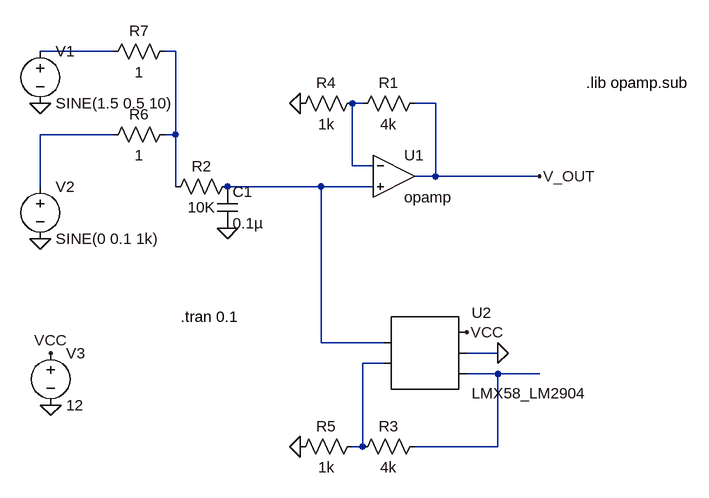
[diagram p0: schematic SensorAmplification.asc]
SensorAmplification.asc, the LTspice schematic file:
Version 4
SHEET 1 880 680
WIRE -656 -48 -768 -48
WIRE -560 -48 -576 -48
WIRE -272 32 -288 32
WIRE -160 32 -192 32
WIRE -656 80 -768 80
WIRE -560 80 -560 -48
WIRE -560 80 -576 80
WIRE -288 128 -288 32
WIRE -256 128 -288 128
WIRE -160 144 -160 32
WIRE -160 144 -192 144
WIRE 0 144 -160 144
WIRE -768 160 -768 80
WIRE -560 160 -560 80
WIRE -336 160 -480 160
WIRE -256 160 -336 160
WIRE -336 400 -336 160
WIRE -240 400 -336 400
WIRE -64 416 -112 416
WIRE -240 432 -272 432
WIRE -64 448 -112 448
WIRE 0 448 -64 448
WIRE -272 560 -272 432
WIRE -272 560 -288 560
WIRE -64 560 -64 448
WIRE -64 560 -192 560
FLAG 0 144 V_OUT
FLAG -768 32 0
FLAG -480 224 0
FLAG -368 32 0
FLAG -768 240 0
FLAG -368 560 0
FLAG -64 416 0
FLAG -752 496 0
FLAG -752 416 VCC
FLAG -112 384 VCC
SYMBOL Opamps\\opamp -224 80 R0
SYMATTR InstName U1
SYMBOL res -176 16 R90
WINDOW 0 0 56 VBottom 2
WINDOW 3 32 56 VTop 2
SYMATTR InstName R1
SYMATTR Value 4k
SYMBOL res -464 144 R90
WINDOW 0 0 56 VBottom 2
WINDOW 3 32 56 VTop 2
SYMATTR InstName R2
SYMATTR Value 10K
SYMBOL cap -496 160 R0
SYMATTR InstName C1
SYMATTR Value 0.1µ
SYMBOL voltage -768 -64 R0
WINDOW 123 0 0 Left 0
WINDOW 39 0 0 Left 0
SYMATTR InstName V1
SYMATTR Value SINE(1.5 0.5 10)
SYMBOL res -272 16 R90
WINDOW 0 0 56 VBottom 2
WINDOW 3 32 56 VTop 2
SYMATTR InstName R4
SYMATTR Value 1k
SYMBOL voltage -768 144 R0
WINDOW 123 0 0 Left 0
WINDOW 39 0 0 Left 0
SYMATTR InstName V2
SYMATTR Value SINE(0 0.1 1k)
SYMBOL res -560 64 R90
WINDOW 0 0 56 VBottom 2
WINDOW 3 32 56 VTop 2
SYMATTR InstName R6
SYMATTR Value 1
SYMBOL res -560 -64 R90
WINDOW 0 0 56 VBottom 2
WINDOW 3 32 56 VTop 2
SYMATTR InstName R7
SYMATTR Value 1
SYMBOL AutoGenerated\\LMX58_LM2904 -176 416 R0
SYMATTR InstName U2
SYMBOL res -176 544 R90
WINDOW 0 0 56 VBottom 2
WINDOW 3 32 56 VTop 2
SYMATTR InstName R3
SYMATTR Value 4k
SYMBOL res -272 544 R90
WINDOW 0 0 56 VBottom 2
WINDOW 3 32 56 VTop 2
SYMATTR InstName R5
SYMATTR Value 1k
SYMBOL voltage -752 400 R0
WINDOW 123 0 0 Left 0
WINDOW 39 0 0 Left 0
SYMATTR InstName V3
SYMATTR Value 12
TEXT 72 0 Left 2 !.lib opamp.sub
TEXT -552 360 Left 2 !.tran 0.1

The netlist it stands for:
* SensorAmplification.asc
XU1 N003 N005 V_OUT opamp Aol=100K GBW=10Meg  ; pins invin noninvin out
R1 V_OUT N003 4k
R2 N005 N002 10K
C1 N005 0 0.1µ
V1 N001 0 SINE(1.5 0.5 10)
R4 N003 0 1k
V2 N004 0 SINE(0 0.1 1k)
R6 N002 N004 1
R7 N002 N001 1
* U2: LMX58_LM2904 (symbol AutoGenerated\LMX58_LM2904 not available, pins judged from their places): pin1=N005 pin2=N006 pin3=VCC pin4=0 pin5=N007
R3 N007 N006 4k
R5 N006 0 1k
V3 VCC 0 12
.lib opamp.sub
.tran 0.1
.backanno
.end